# EAGLE design diag (EAGLE 6.5.0)

## Sheet 1 of 2
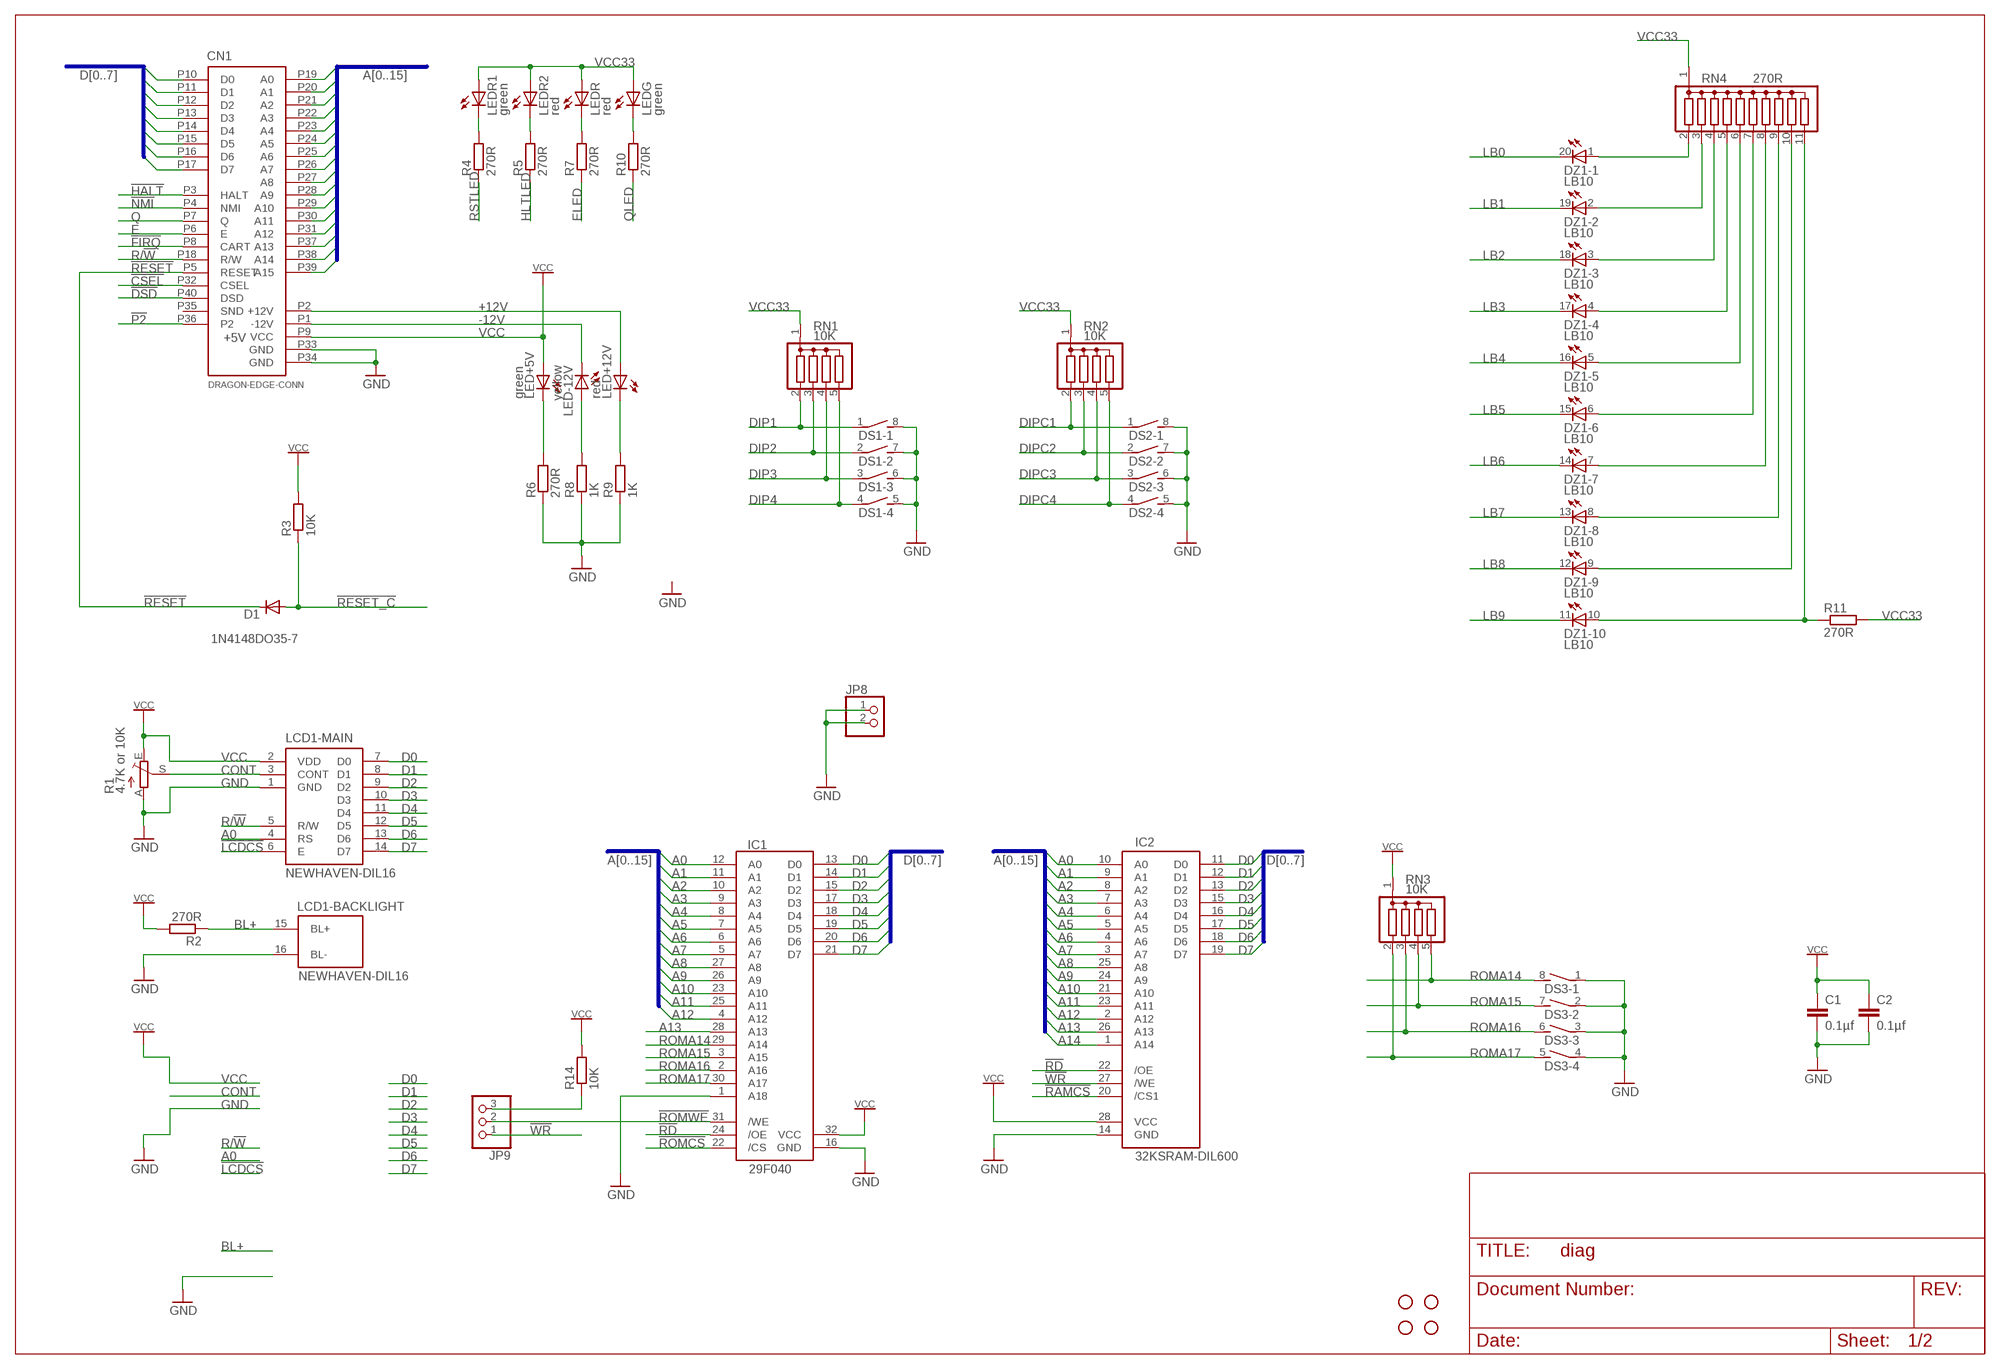
[diagram p0: schematic, sheet 1]

### Parts
C1  0.1µf  C-EU025-025X050  [C025-025X050]
C2  0.1µf  C-EU025-025X050  [C025-025X050]
CN1  DRAGON-EDGE-CONN  [EDGE-40-01]
D1  1N4148DO35-7  [DO35-7]
DS1  DIP04S  [DIP04S]
DS2  DIP04S  [DIP04S]
DS3  DIP04S  [DIP04S]
DZ1  LB10  [LB10]
IC1  29F040  [DIL32]
IC2  32KSRAM-DIL600  [DIL28-6]
JP1  STAND-OFF  [STAND-OFF]
JP2  STAND-OFF  [STAND-OFF]
JP3  STAND-OFF  [STAND-OFF]
JP4  STAND-OFF  [STAND-OFF]
JP8  PINHD-1X2  [1X02]
JP9  PINHD-1X3  [1X03]
LCD1  NEWHAVEN-DIL16  [2X08]
LED+5V  green  LED3MM  [LED3MM]
LED+12V  red  LED3MM  [LED3MM]
LED-12V  yellow  LED3MM  [LED3MM]
LEDG  green  LED3MM  [LED3MM]
LEDR  red  LED3MM  [LED3MM]
LEDR1  green  LED3MM  [LED3MM]
LEDR2  red  LED3MM  [LED3MM]
R1  4.7K or 10K  TRIM_EU-CA9V  [CA9V]
R2  270R  R-EU_0207/10  [0207/10]
R3  10K  R-EU_0204/7  [0204/7]
R4  270R  R-EU_0207/10  [0207/10]
R5  270R  R-EU_0207/10  [0207/10]
R6  270R  R-EU_0207/10  [0207/10]
R7  270R  R-EU_0207/10  [0207/10]
R8  1K  R-EU_0207/10  [0207/10]
R9  1K  R-EU_0207/10  [0207/10]
R10  270R  R-EU_0207/10  [0207/10]
R11  270R  R-EU_0207/10  [0207/10]
R14  10K  R-EU_0207/10  [0207/10]
RN1  10K  G04R  [SIL5]
RN2  10K  G04R  [SIL5]
RN3  10K  G04R  [SIL5]
RN4  270R  G10R  [SIL11]

### Nets
!CSEL: CN1.P32(CSEL) ; also sheet 2
!DSD: CN1.P40(DSD) ; also sheet 2
!FIRQ: CN1.P8(CART) ; also sheet 2
!HALT: CN1.P3(HALT) ; also sheet 2
!LCDCS: LCD1.6(-MAIN:E) ; also sheet 2
!NMI: CN1.P4(NMI) ; also sheet 2
!P2: CN1.P36(P2) ; also sheet 2
!RAMCS: IC2.20(/CS1) ; also sheet 2
!RD: IC1.24(/OE) IC2.22(/OE) ; also sheet 2
!RESET: CN1.P5(RESET) D1.C
!RESET_C: D1.A R3.1 ; also sheet 2
!ROMCS: IC1.22(/CS) ; also sheet 2
!ROMWE: IC1.31(/WE) JP9.2
!WR: IC2.27(/WE) JP9.1 ; also sheet 2
+12V: CN1.P2(+12V) LED+12V.A
-12V: CN1.P1(-12V) LED-12V.K(C)
A0: CN1.P19(A0) IC1.12(A0) IC2.10(A0) LCD1.4(-MAIN:RS) ; also sheet 2
A1: CN1.P20(A1) IC1.11(A1) IC2.9(A1) ; also sheet 2
A2: CN1.P21(A2) IC1.10(A2) IC2.8(A2) ; also sheet 2
A3: CN1.P22(A3) IC1.9(A3) IC2.7(A3) ; also sheet 2
A4: CN1.P23(A4) IC1.8(A4) IC2.6(A4) ; also sheet 2
A5: CN1.P24(A5) IC1.7(A5) IC2.5(A5) ; also sheet 2
A6: CN1.P25(A6) IC1.6(A6) IC2.4(A6) ; also sheet 2
A7: CN1.P26(A7) IC1.5(A7) IC2.3(A7) ; also sheet 2
A8: CN1.P27(A8) IC1.27(A8) IC2.25(A8) ; also sheet 2
A9: CN1.P28(A9) IC1.26(A9) IC2.24(A9) ; also sheet 2
A10: CN1.P29(A10) IC1.23(A10) IC2.21(A10) ; also sheet 2
A11: CN1.P30(A11) IC1.25(A11) IC2.23(A11) ; also sheet 2
A12: CN1.P31(A12) IC1.4(A12) IC2.2(A12) ; also sheet 2
A13: CN1.P37(A13) IC1.28(A13) IC2.26(A13) ; also sheet 2
A14: CN1.P38(A14) IC2.1(A14) ; also sheet 2
A15: CN1.P39(A15) ; also sheet 2
BL+: LCD1.15(-BACKLIGHT:BL+) R2.1
CONT: LCD1.3(-MAIN:CONT) R1.S
D0: CN1.P10(D0) IC1.13(D0) IC2.11(D0) LCD1.7(-MAIN:D0) ; also sheet 2
D1: CN1.P11(D1) IC1.14(D1) IC2.12(D1) LCD1.8(-MAIN:D1) ; also sheet 2
D2: CN1.P12(D2) IC1.15(D2) IC2.13(D2) LCD1.9(-MAIN:D2) ; also sheet 2
D3: CN1.P13(D3) IC1.17(D3) IC2.15(D3) LCD1.10(-MAIN:D3) ; also sheet 2
D4: CN1.P14(D4) IC1.18(D4) IC2.16(D4) LCD1.11(-MAIN:D4) ; also sheet 2
D5: CN1.P15(D5) IC1.19(D5) IC2.17(D5) LCD1.12(-MAIN:D5) ; also sheet 2
D6: CN1.P16(D6) IC1.20(D6) IC2.18(D6) LCD1.13(-MAIN:D6) ; also sheet 2
D7: CN1.P17(D7) IC1.21(D7) IC2.19(D7) LCD1.14(-MAIN:D7) ; also sheet 2
DIP1: DS1.1 RN1.2 ; also sheet 2
DIP2: DS1.2 RN1.3 ; also sheet 2
DIP3: DS1.3 RN1.4 ; also sheet 2
DIP4: DS1.4 RN1.5 ; also sheet 2
DIPC1: DS2.1 RN2.2 ; also sheet 2
DIPC2: DS2.2 RN2.3 ; also sheet 2
DIPC3: DS2.3 RN2.4 ; also sheet 2
DIPC4: DS2.4 RN2.5 ; also sheet 2
E: CN1.P6(E) ; also sheet 2
ELED: R7.1 ; also sheet 2
GND: C1.2 C2.2 CN1.P33(GND) CN1.P34(GND) DS1.5 DS1.6 DS1.7 DS1.8 DS2.5 DS2.6 DS2.7 DS2.8 DS3.1 DS3.2 DS3.3 DS3.4 IC1.1(A18) IC1.16(GND) IC2.14(GND) JP8.1 JP8.2 LCD1.1(-MAIN:GND) LCD1.16(-BACKLIGHT:BL-) R1.A R6.1 R8.1 R9.1 ; also sheet 2
HLTLED: R5.1 ; also sheet 2
LB0: DZ1.20(-1:C) ; also sheet 2
LB1: DZ1.19(-2:C) ; also sheet 2
LB2: DZ1.18(-3:C) ; also sheet 2
LB3: DZ1.17(-4:C) ; also sheet 2
LB4: DZ1.16(-5:C) ; also sheet 2
LB5: DZ1.15(-6:C) ; also sheet 2
LB6: DZ1.14(-7:C) ; also sheet 2
LB7: DZ1.13(-8:C) ; also sheet 2
LB8: DZ1.12(-9:C) ; also sheet 2
LB9: DZ1.11(-10:C) ; also sheet 2
N$1: LED+12V.K(C) R9.2
N$2: LED+5V.K(C) R6.2
N$3: DZ1.1(-1:A) RN4.2
N$4: DZ1.2(-2:A) RN4.3
N$5: LED-12V.A R8.2
N$6: DZ1.3(-3:A) RN4.4
N$7: DZ1.4(-4:A) RN4.5
N$8: DZ1.5(-5:A) RN4.6
N$9: DZ1.6(-6:A) RN4.7
N$10: LEDR.K(C) R7.2
N$11: DZ1.7(-7:A) RN4.8
N$12: DZ1.8(-8:A) RN4.9
N$13: LEDG.K(C) R10.2
N$14: DZ1.9(-9:A) RN4.10
N$15: DZ1.10(-10:A) R11.1 RN4.11
N$16: LEDR1.K(C) R4.2
N$17: LEDR2.K(C) R5.2
N$18: JP9.3 R14.1
Q: CN1.P7(Q) ; also sheet 2
QLED: R10.1 ; also sheet 2
R/!W: CN1.P18(R/W) LCD1.5(-MAIN:R/W) ; also sheet 2
ROMA14: DS3.8 IC1.29(A14) RN3.5
ROMA15: DS3.7 IC1.3(A15) RN3.4
ROMA16: DS3.6 IC1.2(A16) RN3.3
ROMA17: DS3.5 IC1.30(A17) RN3.2
RSTLED: R4.1 ; also sheet 2
VCC: C1.1 C2.1 CN1.P9(VCC) IC1.32(VCC) IC2.28(VCC) LCD1.2(-MAIN:VDD) LED+5V.A R1.E R2.2 R3.2 R14.2 RN3.1 ; also sheet 2
VCC33: LEDG.A LEDR1.A LEDR2.A LEDR.A R11.2 RN1.1 RN2.1 RN4.1 ; also sheet 2
Unconnected: CN1.P35(SND)

### Buses
A[0..15]
D[0..7]

## Sheet 2 of 2
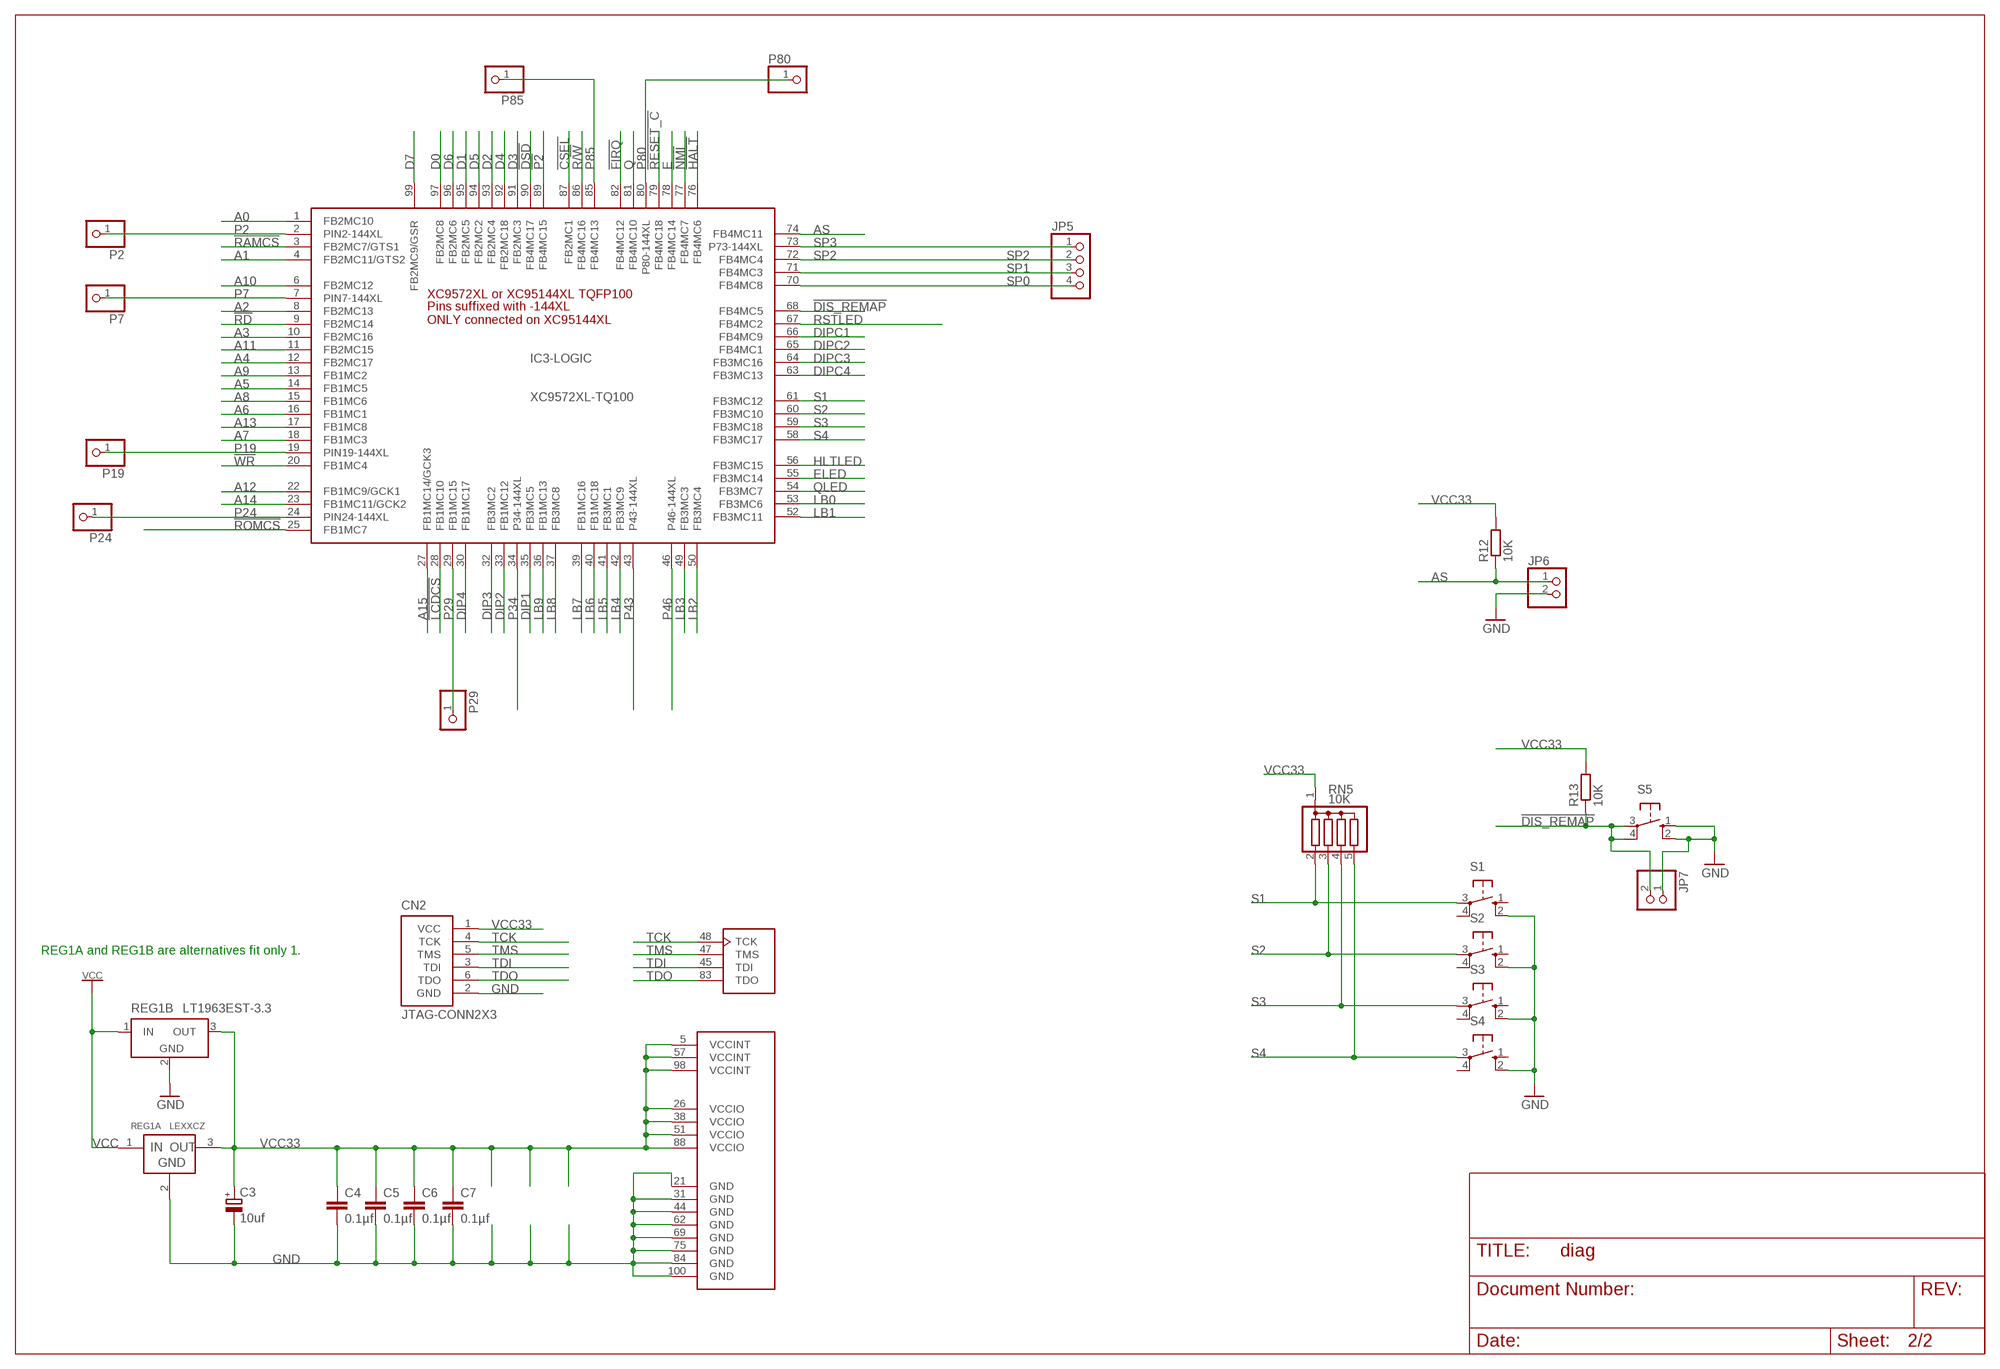
[diagram p1: schematic, sheet 2]

### Parts
C3  10uf  CPOL-EUTT2D7  [TT2D7]
C4  0.1µf  C-EU025-025X050  [C025-025X050]
C5  0.1µf  C-EU025-025X050  [C025-025X050]
C6  0.1µf  C-EU025-025X050  [C025-025X050]
C7  0.1µf  C-EU025-025X050  [C025-025X050]
CN2  JTAG-CONN2X3  [2X3]
IC3  XC9572XL-TQ100  [TQ100]
JP5  PINHD-1X4  [1X04]
JP6  PINHD-1X2  [1X02]
JP7  PINHD-1X2  [1X02]
P2  PINHD-1X1  [1X01]
P7  PINHD-1X1  [1X01]
P19  PINHD-1X1  [1X01]
P24  PINHD-1X1  [1X01]
P29  PINHD-1X1  [1X01]
P80  PINHD-1X1  [1X01]
P85  PINHD-1X1  [1X01]
R12  10K  R-EU_0207/10  [0207/10]
R13  10K  R-EU_0207/10  [0207/10]
REG1A  LEXXCZ  [TO92-]
REG1B  LT1963EST-3.3  [SOT223]
RN5  10K  G04R  [SIL5]
S1  10-XX  [B3F-10XX]
S2  10-XX  [B3F-10XX]
S3  10-XX  [B3F-10XX]
S4  10-XX  [B3F-10XX]
S5  10-XX  [B3F-10XX]

### Nets
!CSEL: IC3.87(-LOGIC:FB2MC1) ; also sheet 1
!DIS_REMAP: IC3.68(-LOGIC:FB4MC5) JP7.2 R13.1 S5.3(P) S5.4(P1)
!DSD: IC3.90(-LOGIC:FB4MC17) ; also sheet 1
!FIRQ: IC3.82(-LOGIC:FB4MC12) ; also sheet 1
!HALT: IC3.76(-LOGIC:FB4MC6) ; also sheet 1
!LCDCS: IC3.28(-LOGIC:FB1MC10) ; also sheet 1
!NMI: IC3.77(-LOGIC:FB4MC7) ; also sheet 1
!P2: IC3.89(-LOGIC:FB4MC15) ; also sheet 1
!RAMCS: IC3.3(-LOGIC:FB2MC7/GTS1) ; also sheet 1
!RD: IC3.9(-LOGIC:FB2MC14) ; also sheet 1
!RESET_C: IC3.79(-LOGIC:FB4MC18) ; also sheet 1
!ROMCS: IC3.25(-LOGIC:FB1MC7) ; also sheet 1
!WR: IC3.20(-LOGIC:FB1MC4) ; also sheet 1
A0: IC3.1(-LOGIC:FB2MC10) ; also sheet 1
A1: IC3.4(-LOGIC:FB2MC11/GTS2) ; also sheet 1
A2: IC3.8(-LOGIC:FB2MC13) ; also sheet 1
A3: IC3.10(-LOGIC:FB2MC16) ; also sheet 1
A4: IC3.12(-LOGIC:FB2MC17) ; also sheet 1
A5: IC3.14(-LOGIC:FB1MC5) ; also sheet 1
A6: IC3.16(-LOGIC:FB1MC1) ; also sheet 1
A7: IC3.18(-LOGIC:FB1MC3) ; also sheet 1
A8: IC3.15(-LOGIC:FB1MC6) ; also sheet 1
A9: IC3.13(-LOGIC:FB1MC2) ; also sheet 1
A10: IC3.6(-LOGIC:FB2MC12) ; also sheet 1
A11: IC3.11(-LOGIC:FB2MC15) ; also sheet 1
A12: IC3.22(-LOGIC:FB1MC9/GCK1) ; also sheet 1
A13: IC3.17(-LOGIC:FB1MC8) ; also sheet 1
A14: IC3.23(-LOGIC:FB1MC11/GCK2) ; also sheet 1
A15: IC3.27(-LOGIC:FB1MC14/GCK3) ; also sheet 1
AS: IC3.74(-LOGIC:FB4MC11) JP6.1 R12.1
D0: IC3.97(-LOGIC:FB2MC8) ; also sheet 1
D1: IC3.95(-LOGIC:FB2MC5) ; also sheet 1
D2: IC3.93(-LOGIC:FB2MC4) ; also sheet 1
D3: IC3.91(-LOGIC:FB2MC3) ; also sheet 1
D4: IC3.92(-LOGIC:FB2MC18) ; also sheet 1
D5: IC3.94(-LOGIC:FB2MC2) ; also sheet 1
D6: IC3.96(-LOGIC:FB2MC6) ; also sheet 1
D7: IC3.99(-LOGIC:FB2MC9/GSR) ; also sheet 1
DIP1: IC3.35(-LOGIC:FB3MC5) ; also sheet 1
DIP2: IC3.33(-LOGIC:FB1MC12) ; also sheet 1
DIP3: IC3.32(-LOGIC:FB3MC2) ; also sheet 1
DIP4: IC3.30(-LOGIC:FB1MC17) ; also sheet 1
DIPC1: IC3.66(-LOGIC:FB4MC9) ; also sheet 1
DIPC2: IC3.65(-LOGIC:FB4MC1) ; also sheet 1
DIPC3: IC3.64(-LOGIC:FB3MC16) ; also sheet 1
DIPC4: IC3.63(-LOGIC:FB3MC13) ; also sheet 1
E: IC3.78(-LOGIC:FB4MC14) ; also sheet 1
ELED: IC3.55(-LOGIC:FB3MC14) ; also sheet 1
GND: C3.- C4.2 C5.2 C6.2 C7.2 CN2.2(GND) IC3.21(-POWER:GND) IC3.31(-POWER:GND) IC3.44(-POWER:GND) IC3.62(-POWER:GND) IC3.69(-POWER:GND) IC3.75(-POWER:GND) IC3.84(-POWER:GND) IC3.100(-POWER:GND) JP6.2 JP7.1 REG1A.2(GND) REG1B.2(GND) S1.2(S1) S2.2(S1) S3.2(S1) S4.2(S1) S5.1(S) S5.2(S1) ; also sheet 1
HLTLED: IC3.56(-LOGIC:FB3MC15) ; also sheet 1
LB0: IC3.53(-LOGIC:FB3MC6) ; also sheet 1
LB1: IC3.52(-LOGIC:FB3MC11) ; also sheet 1
LB2: IC3.50(-LOGIC:FB3MC4) ; also sheet 1
LB3: IC3.49(-LOGIC:FB3MC3) ; also sheet 1
LB4: IC3.42(-LOGIC:FB3MC9) ; also sheet 1
LB5: IC3.41(-LOGIC:FB3MC1) ; also sheet 1
LB6: IC3.40(-LOGIC:FB1MC18) ; also sheet 1
LB7: IC3.39(-LOGIC:FB1MC16) ; also sheet 1
LB8: IC3.37(-LOGIC:FB3MC8) ; also sheet 1
LB9: IC3.36(-LOGIC:FB1MC13) ; also sheet 1
P2: IC3.2(-LOGIC:PIN2-144XL) P2.1
P7: IC3.7(-LOGIC:PIN7-144XL) P7.1
P19: IC3.19(-LOGIC:PIN19-144XL) P19.1
P24: IC3.24(-LOGIC:PIN24-144XL) P24.1
P29: IC3.29(-LOGIC:FB1MC15) P29.1
P34: IC3.34(-LOGIC:P34-144XL)
P43: IC3.43(-LOGIC:P43-144XL)
P46: IC3.46(-LOGIC:P46-144XL)
P80: IC3.80(-LOGIC:P80-144XL) P80.1
P85: IC3.85(-LOGIC:FB4MC13) P85.1
Q: IC3.81(-LOGIC:FB4MC10) ; also sheet 1
QLED: IC3.54(-LOGIC:FB3MC7) ; also sheet 1
R/!W: IC3.86(-LOGIC:FB4MC16) ; also sheet 1
RSTLED: IC3.67(-LOGIC:FB4MC2) ; also sheet 1
S1: IC3.61(-LOGIC:FB3MC12) RN5.2 S1.3(P)
S2: IC3.60(-LOGIC:FB3MC10) RN5.3 S2.3(P)
S3: IC3.59(-LOGIC:FB3MC18) RN5.4 S3.3(P)
S4: IC3.58(-LOGIC:FB3MC17) RN5.5 S4.3(P)
SP0: IC3.70(-LOGIC:FB4MC8) JP5.4
SP1: IC3.71(-LOGIC:FB4MC3) JP5.3
SP2: IC3.72(-LOGIC:FB4MC4) JP5.2
SP3: IC3.73(-LOGIC:P73-144XL) JP5.1
TCK: CN2.4(TCK) IC3.48(-JTAG:TCK)
TDI: CN2.3(TDI) IC3.45(-JTAG:TDI)
TDO: CN2.6(TDO) IC3.83(-JTAG:TDO)
TMS: CN2.5(TMS) IC3.47(-JTAG:TMS)
VCC: REG1A.1(IN) REG1B.1(IN) ; also sheet 1
VCC33: C3.+ C4.1 C5.1 C6.1 C7.1 CN2.1(VCC) IC3.5(-POWER:VCCINT) IC3.26(-POWER:VCCIO) IC3.38(-POWER:VCCIO) IC3.51(-POWER:VCCIO) IC3.57(-POWER:VCCINT) IC3.88(-POWER:VCCIO) IC3.98(-POWER:VCCINT) R12.2 R13.2 REG1A.3(OUT) REG1B.3(OUT) RN5.1 ; also sheet 1
Unconnected: S1.1(S) S1.4(P1) S2.1(S) S2.4(P1) S3.1(S) S3.4(P1) S4.1(S) S4.4(P1)

### Notes on the sheet
- REG1A and REG1B are alternatives fit only 1.

## Power pins joined to a net without a drawn wire
GND: REG1B.4(GND)

## Library data of the parts
C1 C2 C4-C7 = rcl:C-EU: CAPACITOR, European symbol
C3 = rcl:CPOL-EU: POLARIZED CAPACITOR, European symbol
CN1 = Conn-Dragon:DRAGON-EDGE-CONN: Dragon expansion edge connector as seen by a cartrage
CN2 = Xilinx-CPLD-2:JTAG-CONN: JTAG ISP for programing Xilinx CPLD chips
D1 = Misc:1N4148: DIODE high speed (Philips)
DS1-DS3 = switch-dil:DIP04S: DIL/CODE SWITCH; OC_FARNELL: unknown; OC_NEWARK: unknown
DZ1 = led:LB10: LED BLOCK 10-LED bar graph, DIL, Siemens
IC1 = Rom-Ram:29F040
IC2 = Rom-Ram:32KSRAM-DIL600
IC3 = Xilinx-CPLD-2:XC9572XL-TQ100: Xilinx XC9672XL in TQFP-100
JP1-JP4 = ramoth board:STAND-OFF: Stand Off This is the mechanical footprint for a #4 phillips button head screw. Use the keepout ring to avoid running the screw head into surrounding components. SKU : PRT-00447
JP5 = pinhead-round:PINHD-1X4: PIN HEADER
JP6-JP8 = pinhead-round:PINHD-1X2: PIN HEADER
JP9 = pinhead-round:PINHD-1X3: PIN HEADER
LCD1 = LCD:NEWHAVEN-DIL16: Newhaven 2x24
LED+5V LED+12V LED-12V LEDG LEDR LEDR1 LEDR2 = led:LED: LED OSRAM: - CHIPLED LG R971, LG N971, LY N971, LG Q971, LY Q971, LO R971, LY R971 LH N974, LH R974 LS Q976, LO Q976, LY Q976 LO Q996 - Hyper CHIPLED LW Q18S LB Q993, LB Q99A, LB R99A - SideLED LS A670, LO A670, LY A670, LG A670, LP A670 LB A673, LV A673, LT A673, LW A673 LH A674 LY A675 LS A676, LA A676, LO A676, LY A676, LW A676 LS A679, LY A679, LG A679 - Hyper Micro SIDELED® LS Y876, LA Y876, LO Y876, LY Y876 LT Y87S - SmartLED LW L88C, LW L88S LB L89C, LB L89S, LG L890 LS L89K, LO L89K, LY L89K LS L896, LA L896, LO L896, LY L896 - TOPLED LS T670, LO T670, LY T670, LG T670, LP T670 LSG T670, LSP T670, LSY T670, LOP T670, LYG T670 LG T671, LOG T671, LSG T671 LB T673, LV T673, LT T673, LW T673 LH T674 LS T676, LA T676, LO T676, LY T676, LB T676, LH T676, LSB T676, LW T676 LB T67C, LV T67C, LT T67C, LS T67K, LO T67K, LY T67K, LW E67C LS E67B, LA E67B, LO E67B, LY E67B, LB E67C, LV E67C, LT E67C LW T67C LS T679, LY T679, LG T679 LS T770, LO T770, LY T770, LG T770, LP T770 LB T773, LV T773, LT T773, LW T773 LH T774 LS E675, LA E675, LY E675, LS T675 LS T776, LA T776, LO T776, LY T776, LB T776 LHGB T686 LT T68C, LB T68C - Hyper Mini TOPLED® LB M676 - Mini TOPLED Santana® LG M470 LS M47K, LO M47K, LY M47K Source: http://www.osram.convergy.de LUXEON: - LUMILED® LXK2-PW12-R00, LXK2-PW12-S00, LXK2-PW14-U00, LXK2-PW14-V00 LXK2-PM12-R00, LXK2-PM12-S00, LXK2-PM14-U00 LXK2-PE12-Q00, LXK2-PE12-R00, LXK2-PE12-S00, LXK2-PE14-T00, LXK2-PE14-U00 LXK2-PB12-K00, LXK2-PB12-L00, LXK2-PB12-M00, LXK2-PB14-N00, LXK2-PB14-P00, LXK2-PB14-Q00 LXK2-PR12-L00, LXK2-PR12-M00, LXK2-PR14-Q00, LXK2-PR14-R00 LXK2-PD12-Q00, LXK2-PD12-R00, LXK2-PD12-S00 LXK2-PH12-R00, LXK2-PH12-S00 LXK2-PL12-P00, LXK2-PL12-Q00, LXK2-PL12-R00 Source: www.luxeon.com KINGBRIGHT: KA-3528ASYC Source: www.kingbright.com
P2 P7 P19 P24 P29 P80 P85 = pinhead-round:PINHD-1X1: PIN HEADER
R1 = pot:TRIM_EU-: POTENTIOMETER
R2-R14 = rcl:R-EU_: RESISTOR, European symbol
REG1A = Misc:LEXXCZ: LEX33CZ 3.3v voltage reg. also available in other voltages, the 2 digits specify the voltage : 33 = 3.3v 50 = 5.0v etc
REG1B = linear-technology:LT1963EST: 1.5A, Low Noise, Fast Transient Response LDO Regulator Source: http://www.linear.com/pc/downloadDocument.do?navId=H0,C3,P2222,D3148; MPN: LT1963EST-3.3; OC_FARNELL: 1501032; OC_NEWARK: 57M7546
RN1-RN3 RN5 = resistor-sil:G04R: SIL RESISTOR; OC_FARNELL: unknown; OC_NEWARK: unknown
RN4 = resistor-sil:G10R: SIL RESISTOR; OC_FARNELL: unknown; OC_NEWARK: unknown
S1-S5 = switch-omron:10-XX: OMRON SWITCH; MPN: B3F-1000; OC_FARNELL: 176432; OC_NEWARK: 36M3542

## Board
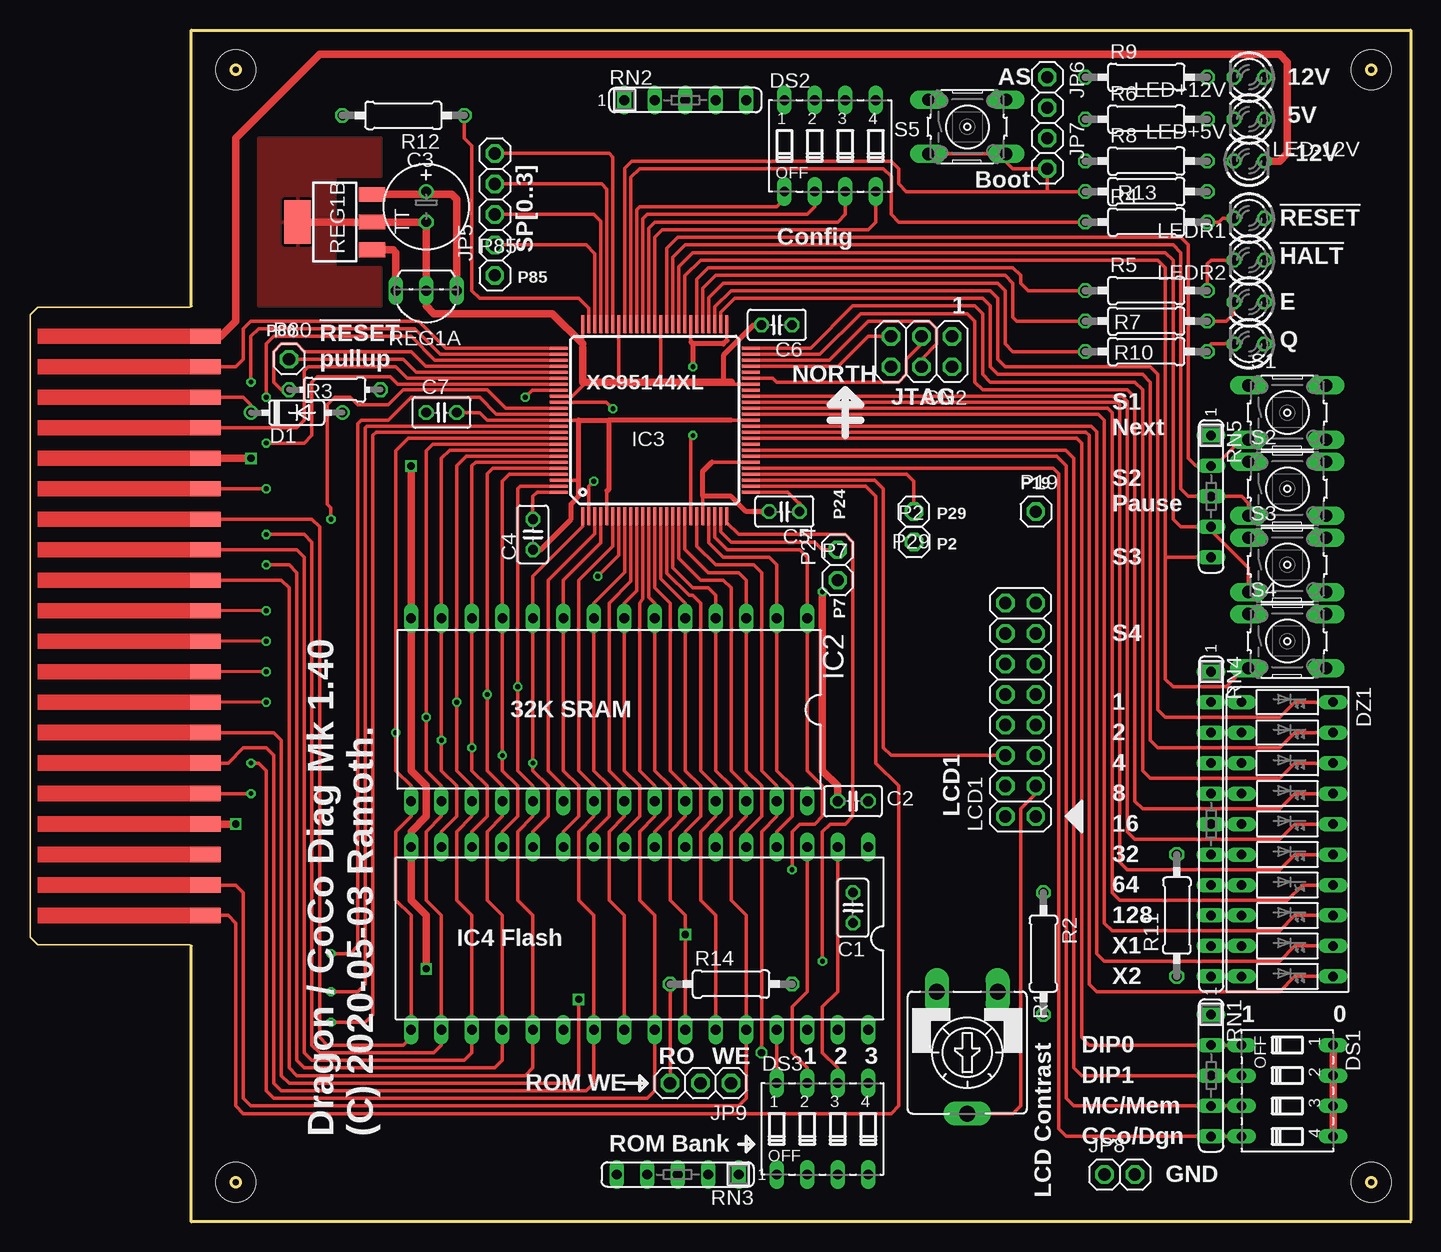
[diagram p2: board, top side]
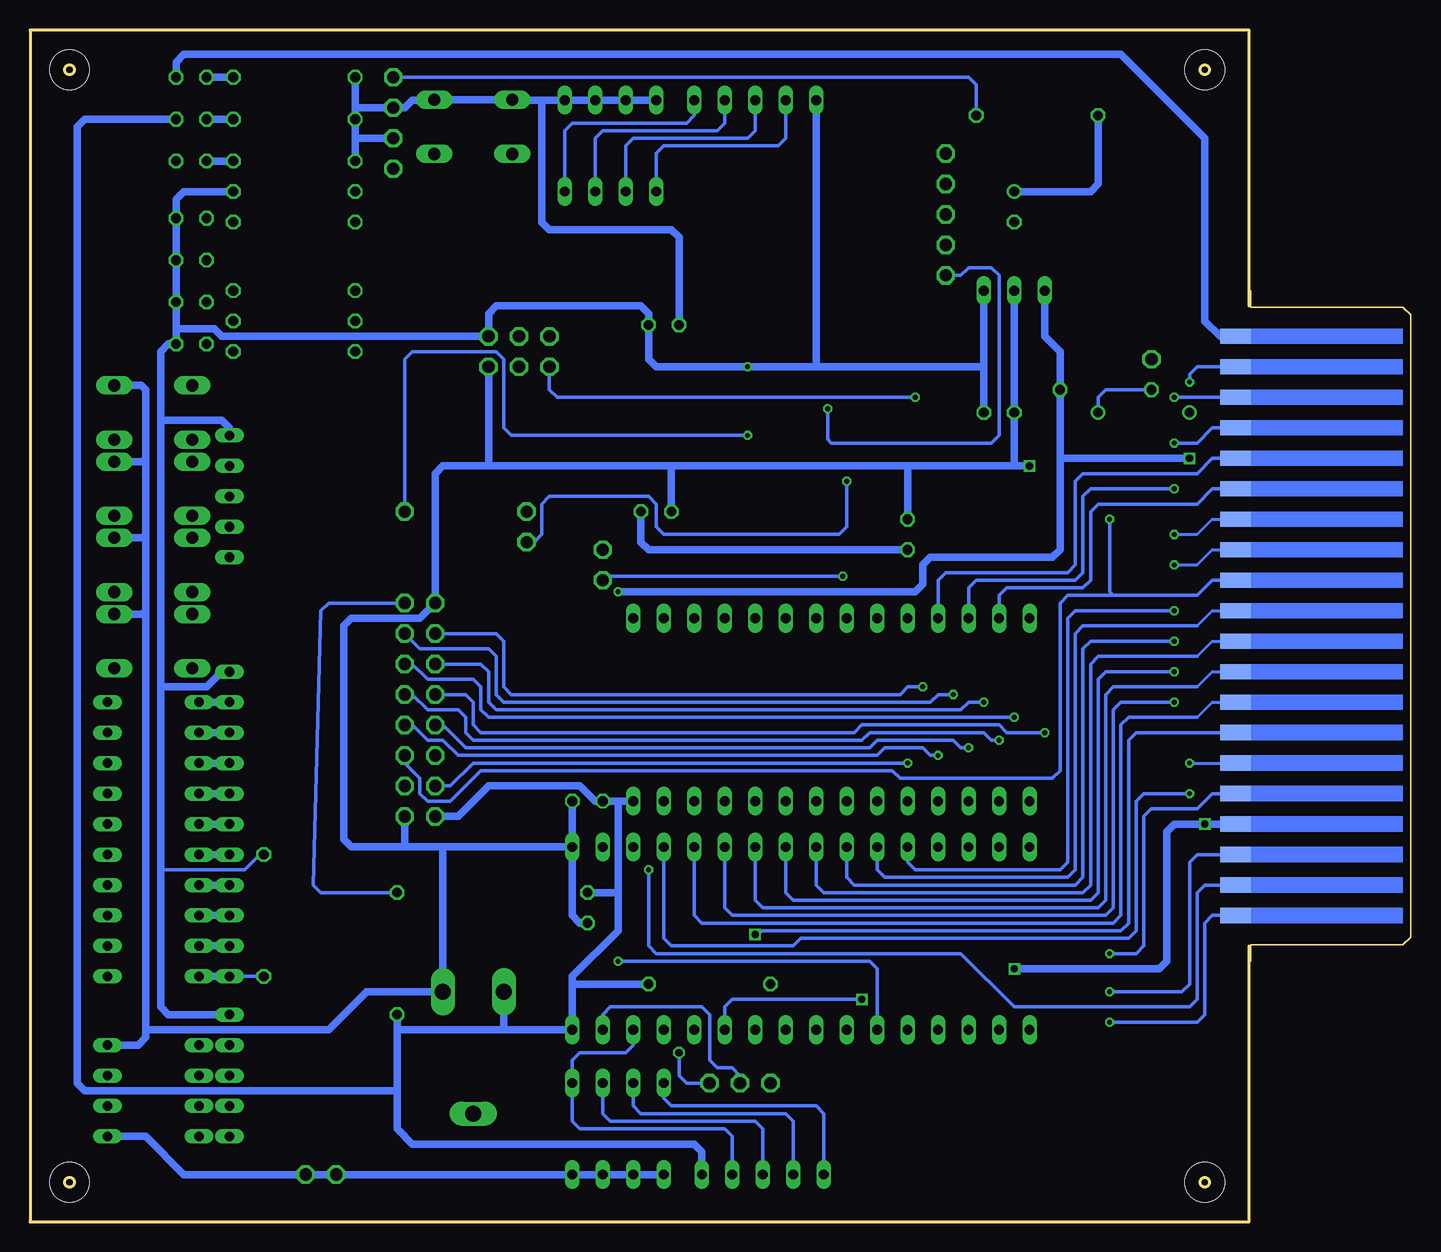
[diagram p3: board, bottom side, seen from below]

Size 115.05 x 99.33 mm. Coordinates in mm from the lower left corner, seen from the top.
Outline: 13.45,76.33 13.45,99.33 115.05,99.33 115.05,0.14
Outline: 115.05,0 13.45,0 13.45,22.99
Copper layers (1*16): Top 0.0356mm / dielectric 1.5011mm / Bottom 0.0356mm
Design rules "oshpark-2layer": minimum track width 6mil, minimum drill 13mil, track to track 6mil, track to pad 6mil, pad to pad 6mil, via to via 6mil, smd to smd 6mil, copper to edge 15mil, drill to drill 6mil, minimum pad ring 7mil, minimum via ring 7mil, stop-mask expansion 4mil, vias tented up to drill 0mil, thermal gap 10mil

### Footprints (pad centres in the part's own frame; a part is rotated, then mirrored left to right if it is on the bottom)
C025-025X050 = drill 0.813 octagon: 1 -1.27,0; 2 1.27,0
TT2D7 = drill 0.813: + -1.27,0 | drill 0.813 octagon: - 1.27,0
EDGE-40-01 = smd 1.27 x 2.54: P1 24.13,-13.97; P3 21.59,-13.97; P5 19.05,-13.97; P7 16.51,-13.97; P9 13.97,-13.97; P11 11.43,-13.97; P13 8.89,-13.97; P15 6.35,-13.97; P17 3.81,-13.97; P19 1.27,-13.97; P21 -1.27,-13.97; P23 -3.81,-13.97; P25 -6.35,-13.97; P27 -8.89,-13.97; P29 -11.43,-13.97; P31 -13.97,-13.97; P33 -16.51,-13.97; P35 -19.05,-13.97; P37 -21.59,-13.97; P39 -24.13,-13.97 | smd 1.27 x 2.54 bottom: P2 24.13,-13.97; P4 21.59,-13.97; P6 19.05,-13.97; P8 16.51,-13.97; P10 13.97,-13.97; P12 11.43,-13.97; P14 8.89,-13.97; P16 6.35,-13.97; P18 3.81,-13.97; P20 1.27,-13.97; P22 -1.27,-13.97; P24 -3.81,-13.97; P26 -6.35,-13.97; P28 -8.89,-13.97; P30 -11.43,-13.97; P32 -13.97,-13.97; P34 -16.51,-13.97; P36 -19.05,-13.97; P38 -21.59,-13.97; P40 -24.13,-13.97
2X3 = drill 1.016 octagon: 1 -2.54,-1.27; 2 -2.54,1.27; 3 0,-1.27; 4 0,1.27; 5 2.54,-1.27; 6 2.54,1.27
DO35-7 = drill 0.813: A 3.81,0; C -3.81,0
DIP04S = drill 0.813 long: 1 -3.81,-3.81; 2 -1.27,-3.81; 3 1.27,-3.81; 4 3.81,-3.81; 5 3.81,3.81; 6 1.27,3.81; 7 -1.27,3.81; 8 -3.81,3.81
LB10 = drill 0.813 long: 1 -11.43,-3.81; 2 -8.89,-3.81; 3 -6.35,-3.81; 4 -3.81,-3.81; 5 -1.27,-3.81; 6 1.27,-3.81; 7 3.81,-3.81; 8 6.35,-3.81; 9 8.89,-3.81; 10 11.43,-3.81; 11 11.43,3.81; 12 8.89,3.81; 13 6.35,3.81; 14 3.81,3.81; 15 1.27,3.81; 16 -1.27,3.81; 17 -3.81,3.81; 18 -6.35,3.81; 19 -8.89,3.81; 20 -11.43,3.81
DIL32 = drill 0.813 long: 1 -19.05,-7.62; 2 -16.51,-7.62; 3 -13.97,-7.62; 4 -11.43,-7.62; 5 -8.89,-7.62; 6 -6.35,-7.62; 7 -3.81,-7.62; 8 -1.27,-7.62; 9 1.27,-7.62; 10 3.81,-7.62; 11 6.35,-7.62; 12 8.89,-7.62; 13 11.43,-7.62; 14 13.97,-7.62; 15 16.51,-7.62; 16 19.05,-7.62; 17 19.05,7.62; 18 16.51,7.62; 19 13.97,7.62; 20 11.43,7.62; 21 8.89,7.62; 22 6.35,7.62; 23 3.81,7.62; 24 1.27,7.62; 25 -1.27,7.62; 26 -3.81,7.62; 27 -6.35,7.62; 28 -8.89,7.62; 29 -11.43,7.62; 30 -13.97,7.62; 31 -16.51,7.62; 32 -19.05,7.62
DIL28-6 = drill 0.813 long: 1 -16.51,-7.62; 2 -13.97,-7.62; 3 -11.43,-7.62; 4 -8.89,-7.62; 5 -6.35,-7.62; 6 -3.81,-7.62; 7 -1.27,-7.62; 8 1.27,-7.62; 9 3.81,-7.62; 10 6.35,-7.62; 11 8.89,-7.62; 12 11.43,-7.62; 13 13.97,-7.62; 14 16.51,-7.62; 15 16.51,7.62; 16 13.97,7.62; 17 11.43,7.62; 18 8.89,7.62; 19 6.35,7.62; 20 3.81,7.62; 21 1.27,7.62; 22 -1.27,7.62; 23 -3.81,7.62; 24 -6.35,7.62; 25 -8.89,7.62; 26 -11.43,7.62; 27 -13.97,7.62; 28 -16.51,7.62
TQ100 = smd 1.5 x 0.254: 1 -8,6; 2 -8,5.5; 3 -8,5; 4 -8,4.5; 5 -8,4; 6 -8,3.5; 7 -8,3; 8 -8,2.5; 9 -8,2; 10 -8,1.5; 11 -8,1; 12 -8,0.5; 13 -8,0; 14 -8,-0.5; 15 -8,-1; 16 -8,-1.5; 17 -8,-2; 18 -8,-2.5; 19 -8,-3; 20 -8,-3.5; 21 -8,-4; 22 -8,-4.5; 23 -8,-5; 24 -8,-5.5; 25 -8,-6; 51 8,-6; 52 8,-5.5; 53 8,-5; 54 8,-4.5; 55 8,-4; 56 8,-3.5; 57 8,-3; 58 8,-2.5; 59 8,-2; 60 8,-1.5; 61 8,-1; 62 8,-0.5; 63 8,0; 64 8,0.5; 65 8,1; 66 8,1.5; 67 8,2; 68 8,2.5; 69 8,3; 70 8,3.5; 71 8,4; 72 8,4.5; 73 8,5; 74 8,5.5; 75 8,6 | smd 0.254 x 1.5: 26 -6,-8; 27 -5.5,-8; 28 -5,-8; 29 -4.5,-8; 30 -4,-8; 31 -3.5,-8; 32 -3,-8; 33 -2.5,-8; 34 -2,-8; 35 -1.5,-8; 36 -1,-8; 37 -0.5,-8; 38 0,-8; 39 0.5,-8; 40 1,-8; 41 1.5,-8; 42 2,-8; 43 2.5,-8; 44 3,-8; 45 3.5,-8; 46 4,-8; 47 4.5,-8; 48 5,-8; 49 5.5,-8; 50 6,-8; 76 6,8; 77 5.5,8; 78 5,8; 79 4.5,8; 80 4,8; 81 3.5,8; 82 3,8; 83 2.5,8; 84 2,8; 85 1.5,8; 86 1,8; 87 0.5,8; 88 0,8; 89 -0.5,8; 90 -1,8; 91 -1.5,8; 92 -2,8; 93 -2.5,8; 94 -3,8; 95 -3.5,8; 96 -4,8; 97 -4.5,8; 98 -5,8; 99 -5.5,8; 100 -6,8
STAND-OFF = hole 3.302: 0,0
1X04 = drill 1.016 octagon: 1 -3.81,0; 2 -1.27,0; 3 1.27,0; 4 3.81,0
1X02 = drill 1.016 octagon: 1 -1.27,0; 2 1.27,0
1X03 = drill 1.016 octagon: 1 -2.54,0; 2 0,0; 3 2.54,0
2X08 = drill 1.016 octagon: 1 -8.89,-1.27; 2 -8.89,1.27; 3 -6.35,-1.27; 4 -6.35,1.27; 5 -3.81,-1.27; 6 -3.81,1.27; 7 -1.27,-1.27; 8 -1.27,1.27; 9 1.27,-1.27; 10 1.27,1.27; 11 3.81,-1.27; 12 3.81,1.27; 13 6.35,-1.27; 14 6.35,1.27; 15 8.89,-1.27; 16 8.89,1.27
LED3MM = drill 0.813 octagon: A -1.27,0; K 1.27,0
1X01 = drill 1.016 octagon: 1 0,0
CA9V = drill 1.321 long: A -2.54,-5.08; E 2.54,-5.08; S 0,5.08
0207/10 = drill 0.813 octagon: 1 -5.08,0; 2 5.08,0
0204/7 = drill 0.813 octagon: 1 -3.81,0; 2 3.81,0
TO92- = drill 0.813 long: 1 2.54,-1.27; 2 0,-1.27; 3 -2.54,-1.27
SOT223 = smd 1.219 x 2.235: 1 -2.311,-3.099; 2 0,-3.099; 3 2.311,-3.099 | smd 3.6 x 2.2: 4 0,3.099
SIL5 = drill 0.813 long: 1 -5.08,0; 2 -2.54,0; 3 0,0; 4 2.54,0; 5 5.08,0
SIL11 = drill 0.813 long: 1 -12.7,0; 2 -10.16,0; 3 -7.62,0; 4 -5.08,0; 5 -2.54,0; 6 0,0; 7 2.54,0; 8 5.08,0; 9 7.62,0; 10 10.16,0; 11 12.7,0
B3F-10XX = drill 1.016 long: 1 -3.251,2.261; 2 3.251,2.261; 3 -3.251,-2.261; 4 3.251,-2.261

### Placement (x,y rotation side)
C1  68.58,26.18 270 top
C2  68.58,35.07 0 top
C3  33.02,84.59 270 top
C4  41.91,57.29 90 top
C5  62.86,59.2 180 top
C6  62.23,74.75 180 top
C7  34.29,67.45 180 top
CN1  0.64,49.67 90 top
CN2  74.3,72.53 180 top
D1  22.23,67.45 0 top
DS1  104.78,10.94 270 top
DS2  66.68,89.67 0 top
DS3  66.04,7.76 0 top
DZ1  104.78,31.89 270 top
IC1  50.8,23.63 180 top
IC2  48.26,42.69 180 top
IC3  52.07,66.81 90 top
JP1  17.15,96.02 0 top
JP2  111.76,3.31 0 top
JP3  17.15,3.31 0 top
JP4  111.76,96.02 0 top
JP5  38.73,85.23 90 top
JP6  84.77,94.12 270 top
JP7  84.77,89.04 270 top
JP8  90.81,3.95 0 top
JP9  55.88,11.57 180 top
LCD1  82.55,42.69 90 top
LED+5V  101.6,91.9 180 top
LED+12V  101.6,95.39 180 top
LED-12V  101.6,88.41 0 top
LEDG  101.6,73.16 180 top
LEDR  101.6,76.66 180 top
LEDR1  101.6,83.64 180 top
LEDR2  101.6,80.15 180 top
P2  73.66,56.66 0 top
P7  67.31,53.48 0 top
P19  83.82,59.2 0 top
P24  67.31,56.02 90 top
P29  73.66,59.2 180 top
P80  21.59,71.89 0 top
P85  38.73,78.88 0 top
R1  78.11,14.11 180 top
R2  84.45,22.36 270 top
R3  25.4,69.35 0 top
R4  93.03,83.32 0 top
R5  93.03,77.61 0 top
R6  93.03,91.9 0 top
R7  93.03,75.07 0 top
R8  93.03,88.41 0 top
R9  93.03,95.39 0 top
R10  93.03,72.53 0 top
R11  95.57,25.54 90 top
R12  31.12,92.21 180 top
R13  93.03,85.86 0 top
R14  58.42,19.82 0 top
REG1A  33.02,76.34 180 top
REG1B  25.4,83.32 90 top
RN1  98.43,12.21 270 top
RN2  54.61,93.48 0 top
RN3  53.98,3.95 180 top
RN4  98.43,33.16 270 top
RN5  98.43,60.47 270 top
S1  104.78,67.45 0 top
S2  104.78,61.1 0 top
S3  104.78,54.75 0 top
S4  104.78,48.4 0 top
S5  78.11,91.26 0 top

### Tracks (layer width: path | path; a pad name or v marks a point on that pad's centre or on a via)
!CSEL  (via drill 0.4)
  Top 0.305: v25.08,22.36 26.67,22.36 27.31,23 27.31,66.5 27.62,66.81 29.85,66.81 31.75,68.72 37.46,68.72 38.87,67.31 IC3.87
  Bottom 0.305: CN1.P32 16.51,35.7 17.78,34.43 21.59,34.43 22.23,33.8 22.23,23 22.86,22.36 v25.08,22.36
!DIS_REMAP
  Top 0.305: IC3.68 49.57,87.81 50.16,88.41 71.76,88.41 72.39,87.77 72.39,86.5 73.03,85.86 84.77,85.86 | 87.63,85.86 R13.1 84.77,85.86 | 84.77,85.86 JP7.2 81.92,87.77 81.36,88.33 S5.4 S5.3
!DSD  (via drill 0.4)
  Top 0.305: v25.08,16.65 27.94,16.65 28.58,17.29 28.58,65.55 28.85,65.81 IC3.90
  Bottom 0.305: CN1.P40 16.51,25.54 17.15,24.9 17.15,17.29 17.78,16.65 v25.08,16.65
!FIRQ  (via drill 0.4)
  Top 0.305: v19.69,64.91 22.86,64.91 23.5,65.55 23.5,69.99 23.96,70.45 30.02,70.45 30.66,69.81 IC3.82
  Bottom 0.305: CN1.P8 16.51,66.18 17.78,64.91 v19.69,64.91
!HALT
  Top 0.305: IC3.76 34.64,72.81 32.38,75.07 18.42,75.07 17.78,74.44 17.78,71.89 17.15,71.26 CN1.P3
!LCDCS
  Top 0.305: IC3.28 70.41,61.82 71.12,61.1 71.12,39.51 71.76,38.88 LCD1.6
!NMI  (via drill 0.4)
  Top 0.305: IC3.77 34.19,72.31 32.07,74.44 19.05,74.44 18.42,73.8 v18.42,69.99
  Bottom 0.305: CN1.P4 17.78,71.26 18.42,70.62 v18.42,69.99
!P2  (via drill 0.4)
  Top 0.305: IC3.89 28.08,66.31 27.94,66.18 27.94,19.82 27.31,19.19 v25.08,19.19
  Bottom 0.305: CN1.P36 17.78,30.62 18.42,29.98 18.42,19.82 19.05,19.19 v25.08,19.19
!RAMCS
  Top 0.305: IC3.3 47.07,57.37 43.18,53.48 43.18,37.61 44.45,36.34 IC2.20
!RD
  Top 0.305: IC1.24 49.53,25.54 48.26,26.81 48.26,32.53 49.53,33.8 IC2.22 49.53,36.34 48.26,37.61 48.26,51.58 50.07,53.39 IC3.9
!RESET
  Top 0.305: CN1.P5 17.78,68.72 18.42,68.08 D1.C
!RESET_C
  Top 0.305: R3.1 20.96,69.35 20.32,69.99 20.32,72.53 20.96,73.16 22.23,73.16 22.86,72.53 31.75,72.53 32.96,71.31 IC3.79
  Bottom 0.305: R3.1 25.4,69.35 26.04,68.72 D1.A
!ROMCS  (via drill 0.4)
  Top 0.305: v66.04,21.73 66.04,32.53 66.68,33.16 67.95,33.16 68.58,33.8 68.58,56.66 67.95,57.29 59.05,57.29 58.07,58.28 IC3.25
  Bottom 0.305: v66.04,21.73 45.09,21.73 44.45,21.09 IC1.22
!ROMWE
  Bottom 0.305: IC1.31 67.31,17.29 66.68,17.92 59.05,17.92 58.42,17.29 58.42,13.48 57.78,12.84 56.52,12.84 55.88,12.21 JP9.2
!WR  (via drill 0.6)
  Top 0.305: IC3.20 55.57,56.33 57.15,54.75 60.32,54.75 60.96,54.12 60.96,37.61 62.23,36.34 IC2.27 62.23,33.8 60.96,32.53 v60.96,14.11
  Bottom 0.305: v60.96,14.11 60.96,12.21 60.32,11.57 JP9.1
+12V
  Bottom 0.61: CN1.P2 15.88,73.8 17.15,75.07 17.15,90.31 24.13,97.3 102.23,97.3 102.87,96.66 LED+12V.A
-12V
  Top 0.61: CN1.P1 15.88,73.8 17.15,75.07 17.15,90.31 24.13,97.3 104.14,97.3 104.78,96.66 104.78,89.04 104.14,88.41 LED-12V.K
A0  (via drill 0.4)
  Top 0.254: v19.69,50.94 CN1.P19
  Top 0.305: IC1.12 41.91,32.53 43.18,33.8 43.18,36.34 41.91,37.61 v41.91,38.24 IC2.10 41.91,53.8 46.07,57.96 IC3.1
  Bottom 0.305: v19.69,50.94 27.94,50.94 28.58,50.3 28.58,29.98 29.21,29.35 41.27,29.35 41.91,29.98 IC1.12 | 41.91,50.94 IC2.10 | LCD1.4 80.01,36.34 78.11,38.24 v41.91,38.24
A1
  Top 0.305: IC1.11 44.45,32.53 45.72,33.8 45.72,36.34 44.45,37.61 IC2.9 44.45,53.48 47.57,56.6 IC3.4
  Bottom 0.254: 17.78,49.67 16.51,50.94 CN1.P20
  Bottom 0.305: 17.78,49.67 27.31,49.67 27.94,49.04 27.94,29.35 28.58,28.71 43.81,28.71 44.45,29.35 IC1.11
A2  (via drill 0.4)
  Top 0.254: v19.69,48.4 CN1.P21
  Top 0.305: IC3.8 49.57,54.16 46.99,51.58 IC2.8 46.99,37.61 48.26,36.34 48.26,33.8 46.99,32.53 IC1.10
  Bottom 0.305: v19.69,48.4 26.67,48.4 27.31,47.77 27.31,28.71 27.94,28.08 46.35,28.08 46.99,28.71 IC1.10
A3
  Top 0.305: IC1.9 49.53,32.53 50.8,33.8 50.8,36.34 49.53,37.61 IC2.7 49.53,51.58 50.57,52.62 IC3.10
  Bottom 0.254: 17.78,47.13 16.51,48.4 CN1.P22
  Bottom 0.305: 17.78,47.13 26.04,47.13 26.67,46.5 26.67,28.08 27.31,27.45 48.89,27.45 49.53,28.08 IC1.9
A4  (via drill 0.4)
  Top 0.254: v19.69,45.86 CN1.P23
  Top 0.305: IC3.12 51.57,52.08 52.07,51.58 IC2.6 52.07,37.61 53.34,36.34 53.34,33.8 52.07,32.53 IC1.8
  Bottom 0.305: v19.69,45.86 25.4,45.86 26.04,45.23 26.04,27.45 26.67,26.81 51.43,26.81 52.07,27.45 IC1.8
A5
  Top 0.305: IC3.14 52.57,53.62 54.61,51.58 IC2.5 54.61,37.61 55.88,36.34 55.88,33.8 54.61,32.53 IC1.7
  Bottom 0.254: 17.78,44.59 16.51,45.86 CN1.P24
  Bottom 0.305: 17.78,44.59 24.77,44.59 25.4,43.96 25.4,26.81 26.04,26.18 53.98,26.18 54.61,26.81 IC1.7
A6  (via drill 0.4)
  Top 0.254: v19.69,43.32 CN1.P25
  Top 0.305: IC3.16 53.57,54.52 55.24,52.85 56.52,52.85 57.15,52.21 IC2.4 57.15,37.61 58.42,36.34 58.42,33.8 57.15,32.53 IC1.6
  Bottom 0.305: v19.69,43.32 24.13,43.32 24.77,42.69 24.77,26.18 25.4,25.54 56.52,25.54 57.15,26.18 IC1.6
A7
  Top 0.305: IC3.18 54.57,56.06 56.52,54.12 59.05,54.12 59.69,53.48 IC2.3 59.69,37.61 60.96,36.34 60.96,33.8 59.69,32.53 IC1.5
  Bottom 0.254: 17.78,42.05 16.51,43.32 CN1.P26
  Bottom 0.305: 17.78,42.05 23.5,42.05 24.13,41.41 24.13,25.54 24.77,24.9 59.05,24.9 59.69,25.54 IC1.5
A8  (via drill 0.6)
  Top 0.305: IC3.15 53.07,54.07 54.93,52.21 55.24,52.21 55.88,51.58 55.88,37.61 57.15,36.34 IC2.25 57.15,33.8 55.88,32.53 55.88,26.81 57.15,25.54 IC1.27 | CN1.P27 20.32,40.78 20.96,40.15 20.96,12.21 21.59,11.57 45.09,11.57 45.72,12.21 v45.72,18.55
  Bottom 0.305: v45.72,18.55 56.52,18.55 57.15,17.92 IC1.27
A9  (via drill 0.6)
  Top 0.305: IC3.13 52.07,52.85 53.34,51.58 53.34,37.61 54.61,36.34 IC2.24 54.61,33.8 53.34,32.53 53.34,26.81 54.61,25.54 v54.61,23.95 IC1.26
  Bottom 0.305: CN1.P28 22.86,40.78 23.5,40.15 23.5,24.9 24.13,24.27 53.98,24.27 v54.61,23.95
A10
  Top 0.305: CN1.P29 16.51,38.24 17.78,39.51 19.69,39.51 20.32,38.88 20.32,11.57 20.96,10.94 46.35,10.94 46.99,11.57 IC1.23 46.99,25.54 45.72,26.81 45.72,32.53 46.99,33.8 IC2.21 46.99,36.34 45.72,37.61 45.72,53.48 48.57,56.33 IC3.6
A11  (via drill 0.4)
  Top 0.305: v18.42,38.24 19.05,38.24 19.69,37.61 19.69,10.94 20.32,10.3 51.43,10.3 52.07,10.94 IC1.25 52.07,25.54 50.8,26.81 50.8,32.53 52.07,33.8 IC2.23 52.07,36.34 50.8,37.61 50.8,51.58 51.07,51.94 IC3.11
  Bottom 0.254: v18.42,38.24 CN1.P30
A12  (via drill 0.4)
  Top 0.305: CN1.P31 v18.42,35.7 | IC1.4 62.23,32.53 63.5,33.8 63.5,36.34 62.23,37.61 IC2.2 62.23,54.75 61.59,55.39 57.78,55.39 56.57,56.6 IC3.22
  Bottom 0.305: v18.42,35.7 22.23,35.7 22.86,35.07 22.86,24.27 23.5,23.63 50.8,23.63 51.43,23 61.59,23 62.23,23.63 IC1.4
A13
  Top 0.305: CN1.P37 17.15,28.08 17.78,27.45 17.78,10.3 18.42,9.67 59.05,9.67 59.69,10.3 IC1.28 59.69,25.54 58.42,26.81 58.42,32.53 59.69,33.8 IC2.26 59.69,36.34 58.42,37.61 58.42,52.85 57.78,53.48 55.88,53.48 54.07,55.29 IC3.17
A14  (via drill 0.4)
  Top 0.305: v63.5,29.35 63.5,32.53 64.14,33.16 65.41,33.16 66.04,33.8 66.04,36.34 64.77,37.61 IC2.1 64.77,55.39 64.14,56.02 58.1,56.02 57.07,57.05 IC3.23
  Bottom 0.305: CN1.P38 17.15,28.08 17.78,27.45 17.78,18.55 18.42,17.92 33.02,17.92 37.46,22.36 62.86,22.36 63.5,23 v63.5,29.35
A15
  Top 0.305: CN1.P39 16.51,25.54 17.15,24.9 17.15,9.67 17.78,9.03 71.76,9.03 72.39,9.67 72.39,36.34 70.48,38.24 70.48,60.47 69.64,61.32 IC3.27
AS
  Top 0.305: IC3.74 46.57,76.12 45.72,76.97 37.46,76.97 36.83,77.61 36.83,89.67 36.2,90.31 R12.1
  Bottom 0.305: JP6.1 36.83,95.39 36.2,94.75 R12.1
BL+
  Bottom 0.305: R2.1 90.81,27.45 91.44,28.08 90.81,50.94 90.17,51.58 LCD1.15
CONT
  Top 0.305: R1.S 81.92,9.03 82.55,9.67 82.55,34.43 83.82,35.7 LCD1.3
D0  (via drill 0.4)
  Top 0.305: IC3.97 39.95,62.32 39.37,61.73 IC2.11 v39.37,38.88 39.37,37.61 40.64,36.34 40.64,33.8 39.37,32.53 IC1.13
  Bottom 0.305: CN1.P10 16.51,63.64 17.78,62.37 27.31,62.37 27.94,61.73 27.94,54.75 28.58,54.12 38.73,54.12 39.37,53.48 IC2.11 | LCD1.7 83.19,41.41 81.92,40.15 80.65,40.15 79.38,38.88 44.45,38.88 43.81,39.51 40.64,39.51 40,38.88 v39.37,38.88
D1  (via drill 0.4)
  Top 0.305: CN1.P11 v19.69,61.1 | IC3.95 37.14,63.32 36.83,63.01 IC2.12 v36.83,39.51 36.83,37.61 38.1,36.34 38.1,33.8 36.83,32.53 IC1.14
  Bottom 0.305: v19.69,61.1 26.67,61.1 27.31,60.47 27.31,54.12 27.94,53.48 36.2,53.48 36.83,52.85 IC2.12 | LCD1.8 80.65,41.41 78.74,39.51 45.09,39.51 44.45,40.15 38.1,40.15 37.46,39.51 v36.83,39.51
D2  (via drill 0.4)
  Top 0.305: IC3.93 34.96,64.31 34.29,63.64 IC2.13 v34.29,40.15 34.29,37.61 35.56,36.34 35.56,33.8 34.29,32.53 IC1.15
  Bottom 0.305: CN1.P12 16.51,61.1 17.78,59.83 26.04,59.83 26.67,59.2 26.67,53.48 27.31,52.85 33.66,52.85 34.29,52.21 IC2.13 | LCD1.9 83.19,43.96 81.92,42.69 79.38,42.69 78.74,42.05 78.74,40.78 78.11,40.15 45.72,40.15 45.09,40.78 35.56,40.78 34.92,40.15 v34.29,40.15
D3  (via drill 0.4)
  Top 0.305: CN1.P13 23.5,58.56 24.13,57.93 24.13,15.38 24.77,14.75 31.12,14.75 31.75,15.38 IC1.17 31.75,25.54 30.48,26.81 30.48,32.53 31.75,33.8 IC2.15 31.75,36.34 30.48,37.61 v30.48,40.78 30.48,64.27 31.52,65.31 IC3.91
  Bottom 0.305: LCD1.10 78.74,43.96 78.11,43.32 78.11,41.41 77.47,40.78 46.35,40.78 45.72,41.41 34.29,41.41 33.66,40.78 v30.48,40.78
D4  (via drill 0.4)
  Top 0.305: v19.69,57.29 22.86,57.29 23.5,56.66 23.5,14.75 24.13,14.11 33.66,14.11 34.29,14.75 IC1.18 34.29,25.54 33.02,26.81 33.02,32.53 34.29,33.8 IC2.16 34.29,36.34 33.02,37.61 v33.02,42.05 33.02,64.27 33.56,64.81 IC3.92
  Bottom 0.254: v19.69,57.29 17.78,57.29 16.51,58.56 CN1.P14
  Bottom 0.305: LCD1.11 83.19,46.5 81.92,45.23 78.11,45.23 77.47,44.59 77.47,42.69 76.84,42.05 v33.02,42.05
D5  (via drill 0.4)
  Top 0.305: CN1.P15 22.23,56.02 22.86,55.39 22.86,14.11 23.5,13.48 36.2,13.48 36.83,14.11 IC1.19 36.83,25.54 35.56,26.81 35.56,32.53 36.83,33.8 IC2.17 36.83,36.34 35.56,37.61 v35.56,43.32 35.56,63.01 36.37,63.82 IC3.94
  Bottom 0.305: LCD1.12 77.47,46.5 76.84,45.86 76.84,43.32 76.2,42.69 37.46,42.69 36.83,43.32 v35.56,43.32
D6  (via drill 0.4)
  Top 0.305: v19.69,54.75 21.59,54.75 22.23,54.12 22.23,13.48 22.86,12.84 38.73,12.84 39.37,13.48 IC1.20 39.37,25.54 38.1,26.81 38.1,32.53 39.37,33.8 IC2.18 39.37,36.34 38.1,37.61 v38.1,43.96 38.1,62.37 38.54,62.82 IC3.96
  Bottom 0.254: v19.69,54.75 17.78,54.75 16.51,56.02 CN1.P16
  Bottom 0.305: LCD1.13 82.55,47.77 76.84,47.77 76.2,47.13 76.2,43.96 75.57,43.32 40,43.32 39.37,43.96 v38.1,43.96
D7  (via drill 0.4)
  Top 0.305: CN1.P17 20.96,53.48 21.59,52.85 21.59,12.84 22.23,12.21 41.27,12.21 41.91,12.84 IC1.21 41.91,25.54 40.64,26.81 40.64,32.53 41.91,33.8 IC2.19 41.91,36.34 40.64,37.61 v40.64,44.59 40.64,61.1 40.85,61.32 IC3.99
  Bottom 0.305: LCD1.14 76.2,49.04 75.57,48.4 75.57,44.59 74.93,43.96 42.54,43.96 41.91,44.59 v40.64,44.59
DIP1
  Top 0.305: DS1.1 RN1.2 88.27,14.75 87.63,15.38 87.63,64.91 87.23,65.31 IC3.35
DIP2
  Top 0.305: DS1.2 RN1.3 87.63,12.21 87,12.84 87,63.64 86.32,64.31 IC3.33
DIP3
  Top 0.305: DS1.3 RN1.4 87,9.67 86.36,10.3 86.36,63.01 85.55,63.82 IC3.32
DIP4
  Top 0.305: DS1.4 RN1.5 86.36,7.12 85.73,7.76 85.73,62.37 85.28,62.82 IC3.30
DIPC1
  Top 0.305: IC3.66 50.57,84.36 50.8,84.59 62.23,84.59 62.86,85.23 DS2.1
  Bottom 0.305: RN2.2 52.07,90.31 52.7,89.67 62.23,89.67 62.86,89.04 DS2.1
DIPC2
  Top 0.305: IC3.65 51.07,83.59 51.43,83.96 64.77,83.96 65.41,84.59 DS2.2
  Bottom 0.305: DS2.2 65.41,89.67 64.77,90.31 55.24,90.31 54.61,90.94 RN2.3
DIPC3
  Top 0.305: IC3.64 51.57,82.82 52.07,83.32 67.31,83.32 67.95,83.96 DS2.3
  Bottom 0.305: DS2.3 67.95,90.31 67.31,90.94 57.78,90.94 57.15,91.58 RN2.4
DIPC4
  Top 0.305: IC3.63 52.07,82.05 52.7,82.69 69.85,82.69 70.48,83.32 DS2.4
  Bottom 0.305: DS2.4 70.48,90.94 69.85,91.58 60.32,91.58 59.69,92.21 RN2.5
E  (via drill 0.4)
  Top 0.305: v19.69,68.72 19.69,73.16 20.32,73.8 31.75,73.8 33.73,71.81 IC3.78
  Bottom 0.305: v19.69,68.72 CN1.P6
ELED
  Top 0.305: IC3.55 56.07,77.8 57.15,78.88 81.28,78.88 81.92,78.24 81.92,75.39 82.23,75.07 R7.1
GND  (via drill 0.6)
  Top 0.305: IC3.84 45.18,68.81 46.07,69.7 46.07,69.99 | IC3.100 42.26,60.82 41.91,60.47 C4.2 | IC3.31 56.82,63.32 | IC3.21 56.07,60.47 | 58.42,69.99 58.59,69.81 IC3.44 57.96,69.81 57.78,69.99 | IC3.69 49.07,70.16 48.89,69.99 | IC3.62 52.57,70.12 52.7,69.99 | IC3.75 46.07,73.16 46.07,72.85
  Top 0.406: 24.77,83.4 REG1B.4 | 56.82,63.32 56.07,62.56 56.07,60.47 58.42,60.47 59.69,59.2 C5.2 | 57.78,69.99 57.78,72.21 60.32,74.75 C6.2
  Top 0.61: REG1B.4 REG1B.2 C3.- REG1A.2 33.02,76.34 33.66,75.7 43.53,75.7 46.07,73.16 | v31.75,63.01 IC2.14 31.75,37.61 33.02,36.34 33.02,33.8 31.75,32.53 IC1.16 31.75,26.81 33.02,25.54 v33.02,21.09 | 58.42,69.99 57.78,69.99 52.7,69.99 48.89,69.99 46.07,69.99 46.07,72.85 | CN1.P33 v17.15,33.16 | DS1.8 DS1.7 DS1.6 DS1.5
  Bottom 0.61: 33.02,63.01 C7.2 REG1A.2 | C4.2 41.91,63.01 | 41.91,63.01 33.02,63.01 | 33.02,63.01 v31.75,63.01 | v33.02,21.09 20.96,21.09 20.32,21.73 20.32,32.53 19.69,33.16 v17.15,33.16 CN1.P33 | IC1.1 C2.2 | R8.1 87.95,90.31 | 87.95,90.31 R6.1 87.95,92.85 | 87.95,92.85 R9.1 | 80.65,31.25 R1.A 87,19.19 90.17,16.02 105.41,16.02 | DS1.5 105.41,7.12 102.23,3.95 JP8.2 JP8.1 DS3.4 DS3.3 DS3.2 DS3.1 | 76.84,63.01 61.59,63.01 | 61.59,63.01 41.91,63.01 | C5.2 61.59,63.01 | 105.41,63.64 105.41,69.35 105.77,69.71 S1.2 | 105.41,63.64 105.41,57.29 | 105.41,57.29 105.41,50.94 | 105.41,50.94 105.41,16.02 | 105.41,16.02 105.41,15.38 106.05,14.75 DS1.8 | 87.95,92.85 JP6.2 83.82,92.85 83.19,93.48 81.39,93.48 S5.2 S5.1 74.82,93.48 72.39,93.48 | CN2.2 76.84,63.01 | 80.65,31.25 83.82,31.25 | 80.65,31.25 IC1.1 | LCD1.1 83.82,31.25 | 76.84,63.01 80.65,63.01 81.28,62.37 LCD1.16 82.55,50.3 88.27,50.3 88.9,49.67 88.9,31.89 88.27,31.25 83.82,31.25 | IC1.1 69.85,25.54 69.22,24.9 C1.2 | C6.2 60.96,82.05 61.59,82.69 71.76,82.69 72.39,83.32 72.39,93.48 | DS2.8 DS2.7 DS2.6 DS2.5 72.39,93.48 | S2.2 105.69,63.36 105.41,63.64 | S4.2 105.69,50.66 105.41,50.94 | S3.2 105.69,57.01 105.41,57.29 | JP7.1 87.95,90.31
  pour Top: 25.4,79.52 25.4,87.13 29.21,87.13 29.21,90.31 19.05,90.31 19.05,76.34 29.21,76.34 29.21,79.52
HLTLED
  Top 0.305: IC3.56 55.57,78.57 56.52,79.52 81.92,79.52 82.55,78.88 82.55,78.24 83.19,77.61 R5.1
LB0
  Top 0.305: DZ1.20 105.41,43.32 104.14,42.05 94.62,42.05 93.98,42.69 93.98,70.62 93.34,71.26 81.28,71.26 80.65,71.89 80.65,76.97 80.01,77.61 58.42,77.61 57.07,76.26 IC3.53
LB1
  Top 0.305: DZ1.19 105.41,40.78 104.14,39.51 93.98,39.51 93.34,40.15 93.34,69.99 92.71,70.62 80.65,70.62 80.01,71.26 80.01,76.34 79.38,76.97 58.74,76.97 57.57,75.81 IC3.52
LB2
  Top 0.305: DZ1.18 105.41,38.24 104.14,36.97 93.34,36.97 92.71,37.61 92.71,69.35 92.08,69.99 80.01,69.99 79.38,70.62 79.38,75.7 78.74,76.34 68.58,76.34 65.06,72.81 IC3.50
LB3
  Top 0.305: DZ1.17 105.41,35.7 104.14,34.43 92.71,34.43 92.08,35.07 92.08,68.72 91.44,69.35 79.38,69.35 78.74,69.99 78.74,75.07 78.11,75.7 69.22,75.7 65.83,72.31 IC3.49
LB4
  Top 0.305: DZ1.16 105.41,33.16 104.14,31.89 92.08,31.89 91.44,32.53 91.44,68.4 91.03,68.81 IC3.42
LB5
  Top 0.305: DZ1.15 105.41,30.62 104.14,29.35 91.44,29.35 90.81,29.98 90.81,68.08 90.58,68.31 IC3.41
LB6
  Top 0.305: DZ1.14 106.05,28.08 104.78,26.81 90.81,26.81 90.17,27.45 90.17,67.45 89.81,67.81 IC3.40
LB7
  Top 0.305: DZ1.13 105.41,25.54 104.14,24.27 90.17,24.27 89.54,24.9 89.54,66.81 89.04,67.31 IC3.39
LB8
  Top 0.305: DZ1.12 105.41,23 104.14,21.73 89.54,21.73 88.9,22.36 88.9,65.86 88.45,66.31 IC3.37
LB9
  Top 0.305: DZ1.11 105.41,20.46 104.14,19.19 88.9,19.19 88.27,19.82 88.27,65.55 88,65.81 IC3.36
N$1
  Bottom 0.61: R9.2 LED+12V.K
N$2
  Bottom 0.61: R6.2 LED+5V.K
N$3
  Bottom 0.61: RN4.2 DZ1.1
N$4
  Bottom 0.61: DZ1.2 RN4.3
N$5
  Bottom 0.61: R8.2 LED-12V.A
N$6
  Bottom 0.61: RN4.4 DZ1.3
N$7
  Bottom 0.61: DZ1.4 RN4.5
N$8
  Bottom 0.61: RN4.6 DZ1.5
N$9
  Bottom 0.61: DZ1.6 RN4.7
N$10
  Top 0.305: R7.2 99.7,75.07 100.33,75.7 LEDR.K
N$11
  Bottom 0.61: RN4.8 DZ1.7
N$12
  Bottom 0.61: DZ1.8 RN4.9
N$13
  Top 0.305: R10.2 98.11,72.85 98.43,73.16 LEDG.K
N$14
  Bottom 0.61: RN4.10 DZ1.9
N$15
  Bottom 0.305: R11.1 RN4.11
  Bottom 0.61: DZ1.10 RN4.11
N$16
  Top 0.305: R4.2 99.06,83.32 99.38,83.64 LEDR1.K
N$17
  Top 0.305: R5.2 98.11,79.83 98.43,80.15 LEDR2.K
N$18
  Top 0.305: JP9.3 R14.1
P2  (via drill 0.4)
  Top 0.305: IC3.2 46.57,61.32 v46.99,61.73
  Bottom 0.305: P2.1 73.03,56.66 72.39,57.29 72.39,59.83 71.76,60.47 63.5,60.47 62.86,59.83 62.86,57.93 62.23,57.29 47.62,57.29 46.99,57.93 v46.99,61.73
P7  (via drill 0.4)
  Top 0.305: IC3.7 49.07,55.56 v47.31,53.8
  Bottom 0.305: v47.31,53.8 66.99,53.8 P7.1
P19  (via drill 0.4)
  Top 0.305: IC3.19 55.07,65.37 v55.24,65.55
  Bottom 0.305: v55.24,65.55 74.93,65.55 75.57,66.18 75.57,71.89 76.2,72.53 83.19,72.53 83.82,71.89 P19.1
P24
  Top 0.305: IC3.24 57.57,57.51 58.42,56.66 65.41,56.66 66.04,56.02 P24.1
P29
  Top 0.305: IC3.29 73.08,62.32 73.66,61.73 P29.1
P80
  Top 0.305: IC3.80 32.2,70.81 31.12,71.89 P80.1
P85  (via drill 0.4)
  Top 0.305: IC3.85 48.03,68.31 v48.58,67.77
  Bottom 0.305: v48.58,67.77 48.58,65.23 48.26,64.91 34.92,64.91 34.29,65.55 34.29,78.88 34.92,79.52 36.83,79.52 37.46,78.88 P85.1
Q
  Top 0.305: CN1.P7 22.23,66.18 22.86,66.81 22.86,70.94 23.19,71.27 30.47,71.27 31.43,70.31 IC3.81
QLED
  Top 0.305: IC3.54 56.57,77.03 57.78,78.24 80.65,78.24 81.28,77.61 81.28,73.16 81.92,72.53 R10.1
R/!W  (via drill 0.4)
  Top 0.305: IC3.86 39.64,67.81 38.1,69.35 31.12,69.35 29.85,68.08 27.31,68.08 26.67,68.72 25.4,68.72 24.77,68.08 24.77,59.83 25.08,59.51 v25.08,58.56
  Bottom 0.305: CN1.P18 16.51,53.48 17.78,52.21 24.77,52.21 | 24.77,52.21 25.08,52.53 v25.08,58.56 | 24.77,52.21 28.58,52.21 29.21,51.58 29.21,37.61 29.85,36.97 42.54,36.97 43.18,37.61 77.47,37.61 80.01,35.07 81.92,35.07 82.55,35.7 82.55,36.97 83.82,38.24 LCD1.5
ROMA14
  Top 0.305: DS3.8 IC1.29
  Bottom 0.305: RN3.5 48.89,9.03 49.53,9.67 61.59,9.67 62.23,10.3 DS3.8
ROMA15
  Top 0.305: IC1.3 64.77,19.19 63.5,17.92 63.5,14.11 64.77,12.84 DS3.7
  Bottom 0.305: RN3.4 51.43,8.4 52.07,9.03 64.14,9.03 64.77,9.67 DS3.7
ROMA16
  Top 0.305: IC1.2 67.31,19.19 66.04,17.92 66.04,14.11 67.31,12.84 DS3.6
  Bottom 0.305: RN3.3 53.98,7.76 54.61,8.4 66.68,8.4 67.31,9.03 DS3.6
ROMA17
  Bottom 0.305: RN3.2 56.52,7.12 57.15,7.76 69.22,7.76 69.85,8.4 DS3.5 69.85,13.48 69.22,14.11 65.41,14.11 64.77,14.75 IC1.30
RSTLED
  Top 0.305: IC3.67 50.07,87.04 50.8,87.77 71.12,87.77 71.76,87.13 71.76,83.96 72.39,83.32 R4.1
S1
  Top 0.305: S1.3 100.93,65.19 99.06,63.32 98.74,63.32 RN5.2 97.16,63.01 96.52,63.64 96.52,81.42 95.89,82.05 53.98,82.05 53.07,81.15 IC3.61
S2
  Top 0.305: S2.3 101.52,59.91 100.97,60.47 RN5.3 96.52,60.47 95.89,61.1 95.89,80.78 95.25,81.42 54.61,81.42 53.57,80.38 IC3.60
S3
  Top 0.305: S3.3 101.52,54.51 98.43,57.61 RN5.4 95.89,57.93 95.25,58.56 95.25,80.15 94.62,80.78 55.24,80.78 54.07,79.61 IC3.59
S4
  Top 0.305: 94.62,55.39 94.62,79.52 93.98,80.15 55.88,80.15 54.57,78.84 IC3.58 | 94.62,55.39 94.62,45.23 95.25,44.59 99.7,44.59 101.24,46.14 S4.3 | RN5.5 94.62,55.39
SP0
  Top 0.305: IC3.70 48.57,88.73 48.26,89.04 JP5.4
SP1
  Top 0.305: IC3.71 48.07,86.05 47.62,86.5 JP5.3
SP2
  Top 0.305: IC3.72 47.57,83.38 46.99,83.96 JP5.2
SP3
  Top 0.305: IC3.73 47.07,80.7 46.35,81.42 JP5.1
TCK
  Top 0.305: IC3.48 66.59,71.81 69.85,75.07 74.93,75.07 75.57,74.44 75.57,73.16 74.3,71.89 CN2.4
TDI
  Top 0.305: IC3.45 61.91,70.31 62.23,69.99 72.39,69.99 73.03,70.62 73.03,71.89 74.3,73.16 CN2.3
TDO  (via drill 0.4)
  Top 0.305: IC3.83 41.87,69.31 v41.27,68.72
  Bottom 0.305: v41.27,68.72 71.12,68.72 71.76,69.35 CN2.6
TMS
  Top 0.305: IC3.47 67.37,71.31 69.85,73.8 CN2.5
VCC  (via drill 0.4, 0.6)
  Top 0.61: v66.04,52.53 66.04,37.61 67.31,36.34 C2.1 | CN1.P9 v18.42,63.64 | REG1B.1 30.25,81.01 30.48,80.78 REG1A.1
  Bottom 0.61: v18.42,63.64 29.21,63.64 | v66.04,52.53 41.27,52.53 40.64,53.16 40.64,54.75 40,55.39 29.85,55.39 29.21,56.02 29.21,63.64 | REG1A.1 30.48,73.8 29.21,72.53 R3.2 29.21,63.64 | RN3.1 59.05,5.85 59.69,6.49 83.19,6.49 84.45,7.76 84.45,10.94 | LED+5V.A 110.49,91.9 111.12,91.26 111.12,11.57 110.49,10.94 84.45,10.94 | 84.45,10.94 84.45,16.02 | 84.45,16.02 75.57,16.02 | 75.57,16.02 IC1.32 69.85,19.82 | R2.2 84.45,16.02 | R1.E 75.57,16.02 | 66.04,35.07 66.04,27.45 | 66.04,27.45 66.04,24.27 69.85,20.46 69.85,19.82 | C1.1 66.04,27.45 | IC2.28 66.04,35.07 | 66.04,35.07 C2.1 67.95,35.07 69.22,36.34 76.84,36.34 79.38,33.8 LCD1.2 | R14.2 69.85,19.82
VCC33  (via drill 0.4)
  Top 0.305: IC3.98 45.72,61.82 | IC3.5 48.07,60.91 | 45.72,66.81 IC3.88 38.1,66.81 37.46,67.45 C7.1 | IC3.51 58.07,73.45 | IC3.26 63.15,60.82 64.14,59.83 | IC3.57 55.07,73.34 | IC3.38 58.42,66.81
  Top 0.406: 58.07,73.45 57.78,73.16 55.24,73.16 | 48.07,60.91 48.26,61.1 48.26,66.81 | 48.26,66.81 45.72,66.81 45.72,61.82 45.72,60.47 45.09,59.83 45.09,58.56 42.54,56.02 C4.1 | 64.14,59.83 C5.1 | 55.07,73.34 55.24,73.16 | 55.24,73.16 v55.24,71.26 | 58.42,66.81 48.26,66.81
  Top 0.61: REG1B.3 33.02,85.64 | 33.02,85.64 35.15,85.64 35.56,85.23 REG1A.3 | C3.+ 33.02,85.64
  Bottom 0.305: R11.2 95.89,30.62 97.16,29.35 104.14,29.35
  Bottom 0.61: C5.1 64.14,56.66 63.5,56.02 C4.1 | C7.1 35.56,71.26 | 35.56,71.26 REG1A.3 | RN1.1 103.51,17.29 104.14,17.92 104.14,29.35 104.14,44.59 | 102.87,74.44 LEDR.A LEDR2.A LEDR1.A 102.87,85.23 102.23,85.86 R13.2 | 102.87,74.44 LEDG.A 103.51,73.16 104.14,72.53 104.14,66.81 | 104.14,66.81 104.14,44.59 | 49.53,71.26 v55.24,71.26 62.86,71.26 63.5,71.89 C6.1 63.5,75.7 64.14,76.34 76.2,76.34 76.84,75.7 CN2.1 99.06,73.8 99.7,74.44 102.87,74.44 | 49.53,71.26 35.56,71.26 | RN4.1 99.06,45.86 100.33,44.59 104.14,44.59 | RN5.1 98.43,66.18 99.06,66.81 104.14,66.81 | R12.2 26.04,86.5 26.67,85.86 C3.+ | RN2.1 49.53,71.26

### Text on the board
tPlace: AS | 12V | 5V | -12V | Boot | !RESET | Config | SP[0..3] | !HALT | P85 | E | 1 | P80 | Q | !RESET! / pullup | XC95144XL | NORTH | JTAG | S1 / Next | P19 | S2 / Pause | P24 | P29 | P2 | S3 | P7 | S4 | 32K SRAM | 1 | 2 | 4 | 8 | LCD1 | 16 | 32 | 64 | 128 | IC4 Flash | X1 | X2 | 1 | 0 | DIP0 | RO | WE | 1 | 2 | 3 | DIP1 | ROM WE | MC/Mem | Dragon / CoCo Diag Mk 1.40 / (C) 2020-05-03 Ramoth. | CCo/Dgn | ROM Bank | GND | LCD Contrast
Reference: Assembly Order / / CPLD, surface mount REG (if fitted) / Resistors + Diode / Ceramic caps. / 3mm LEDS / Pushbuttons / SIL resistors / IC sockets + VR + DIP switches / TO92 REG (if fitted) + 10µf / Jumpers and LCD connector | Resistors / / 7x 220R or 270R / 2x 1K / 4 x10K / / 1x 9x220R or 270R SIL / 4x 4x10K SIL | Capacitors / / 6x 100nf / 1x 10µf | LEDs / / 3x red 3mm (12V, !HALT!, E) / 3x green 3mm (5V, !RESET!, Q) / 1x yellow 3mm (-12V) / 1x 10 way bargraph